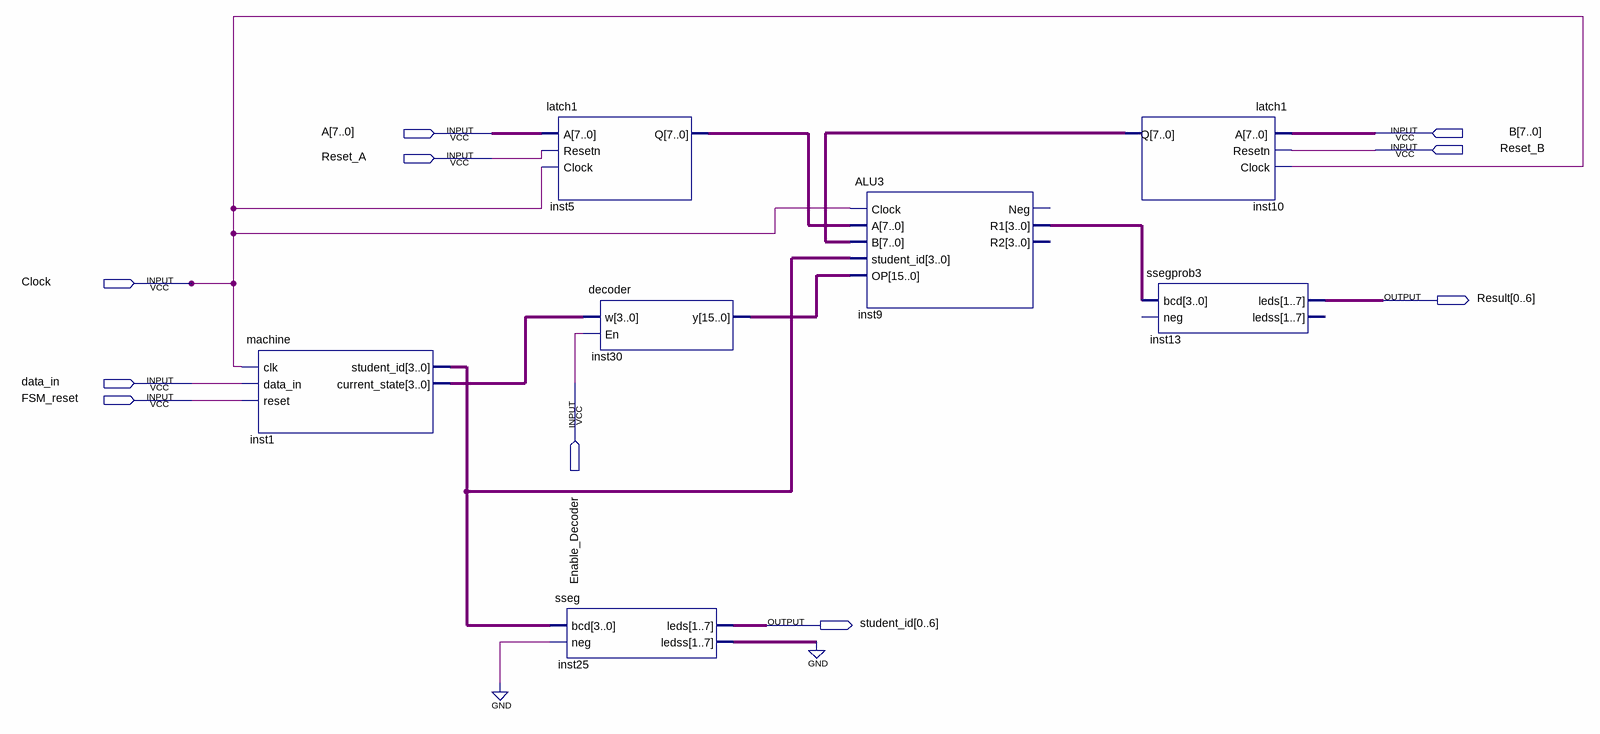
[diagram p0: schematic sheet]
// Quartus schematic lab6problem3.bdf as structural Verilog: 7 symbols, 10 pins
module lab6problem3 (
  input  [7:0] A,
  input  [7:0] B,
  input  Reset_B,
  input  Reset_A,
  input  Clock,
  input  data_in,
  input  Enable_Decoder,
  input  FSM_reset,
  output [0:6] Result,
  output [0:6] student_id
);

  wire [3:0] inst1_current_state, inst1_student_id, inst9_r1;
  wire [6:0] inst25_ledss;
  wire [7:0] inst5_q, inst10_q;
  wire [15:0] inst30_y;

  machine inst1 (
    .clk(Clock), .data_in(data_in), .reset(FSM_reset), .student_id(inst1_student_id),
    .current_state(inst1_current_state));
  latch1 inst5 (.A(A), .Resetn(Reset_A), .Clock(Clock), .Q(inst5_q));
  sseg inst25 (.bcd(inst1_student_id), .neg(1'b0), .leds(student_id), .ledss(inst25_ledss));
  decoder inst30 (.w(inst1_current_state), .En(Enable_Decoder), .y(inst30_y));
  ALU3 inst9 (
    .Clock(Clock), .A(inst5_q), .B(inst10_q), .student_id(inst1_student_id), .OP(inst30_y), .R1(inst9_r1));  // open: Neg, R2
  latch1 inst10 (.A(B), .Resetn(Reset_B), .Clock(Clock), .Q(inst10_q));
  ssegprob3 inst13 (.bcd(inst9_r1), .leds(Result));  // open: neg, ledss
  // also tied to GND on the sheet: {inst25_ledss[0], inst25_ledss[1], inst25_ledss[2], inst25_ledss[3], inst25_ledss[4], inst25_ledss[5], inst25_ledss[6]}
endmodule
